# Altium schematic sheet Cover Page.SchDoc: Cover Page
size A4; Author: DODANHLUONG; Revision: 1.0; SheetNumber: 1; SheetTotal: 5; ProjectTitle: DSP_VERSION_1.0
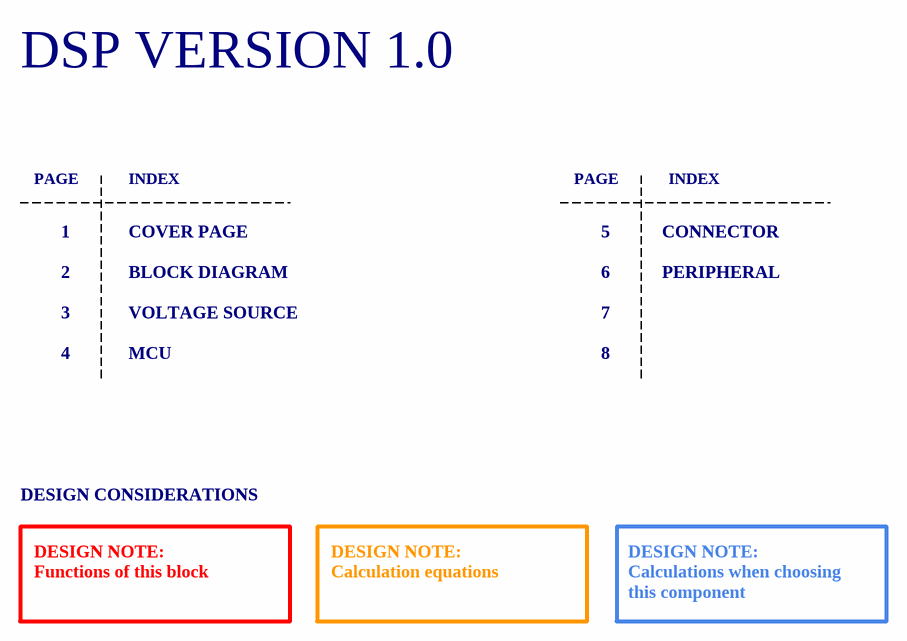
[diagram p0: Cover Page.SchDoc]

## Notes on the sheet
- DSP VERSION 1.0
- PAGE
- INDEX
- 1
- 2
- COVER PAGE
- BLOCK DIAGRAM
- 5
- 6
- CONNECTOR
- PERIPHERAL
- 3
- 4
- VOLTAGE SOURCE
- MCU
- 7
- 8
- DESIGN CONSIDERATIONS
- DESIGN NOTE:
  Functions of this block
- DESIGN NOTE:
  Calculation equations
- DESIGN NOTE:
  Calculations when choosing this component
- Author:
- Title:
- Size:
- A4
- Project:
- Approved:
- Revision:
- Modified Date:
- CONFIDENTIAL
- Date:
- SW Version: